# EAGLE schematic 3D-Druck-Platine (EAGLE 7.4.0)
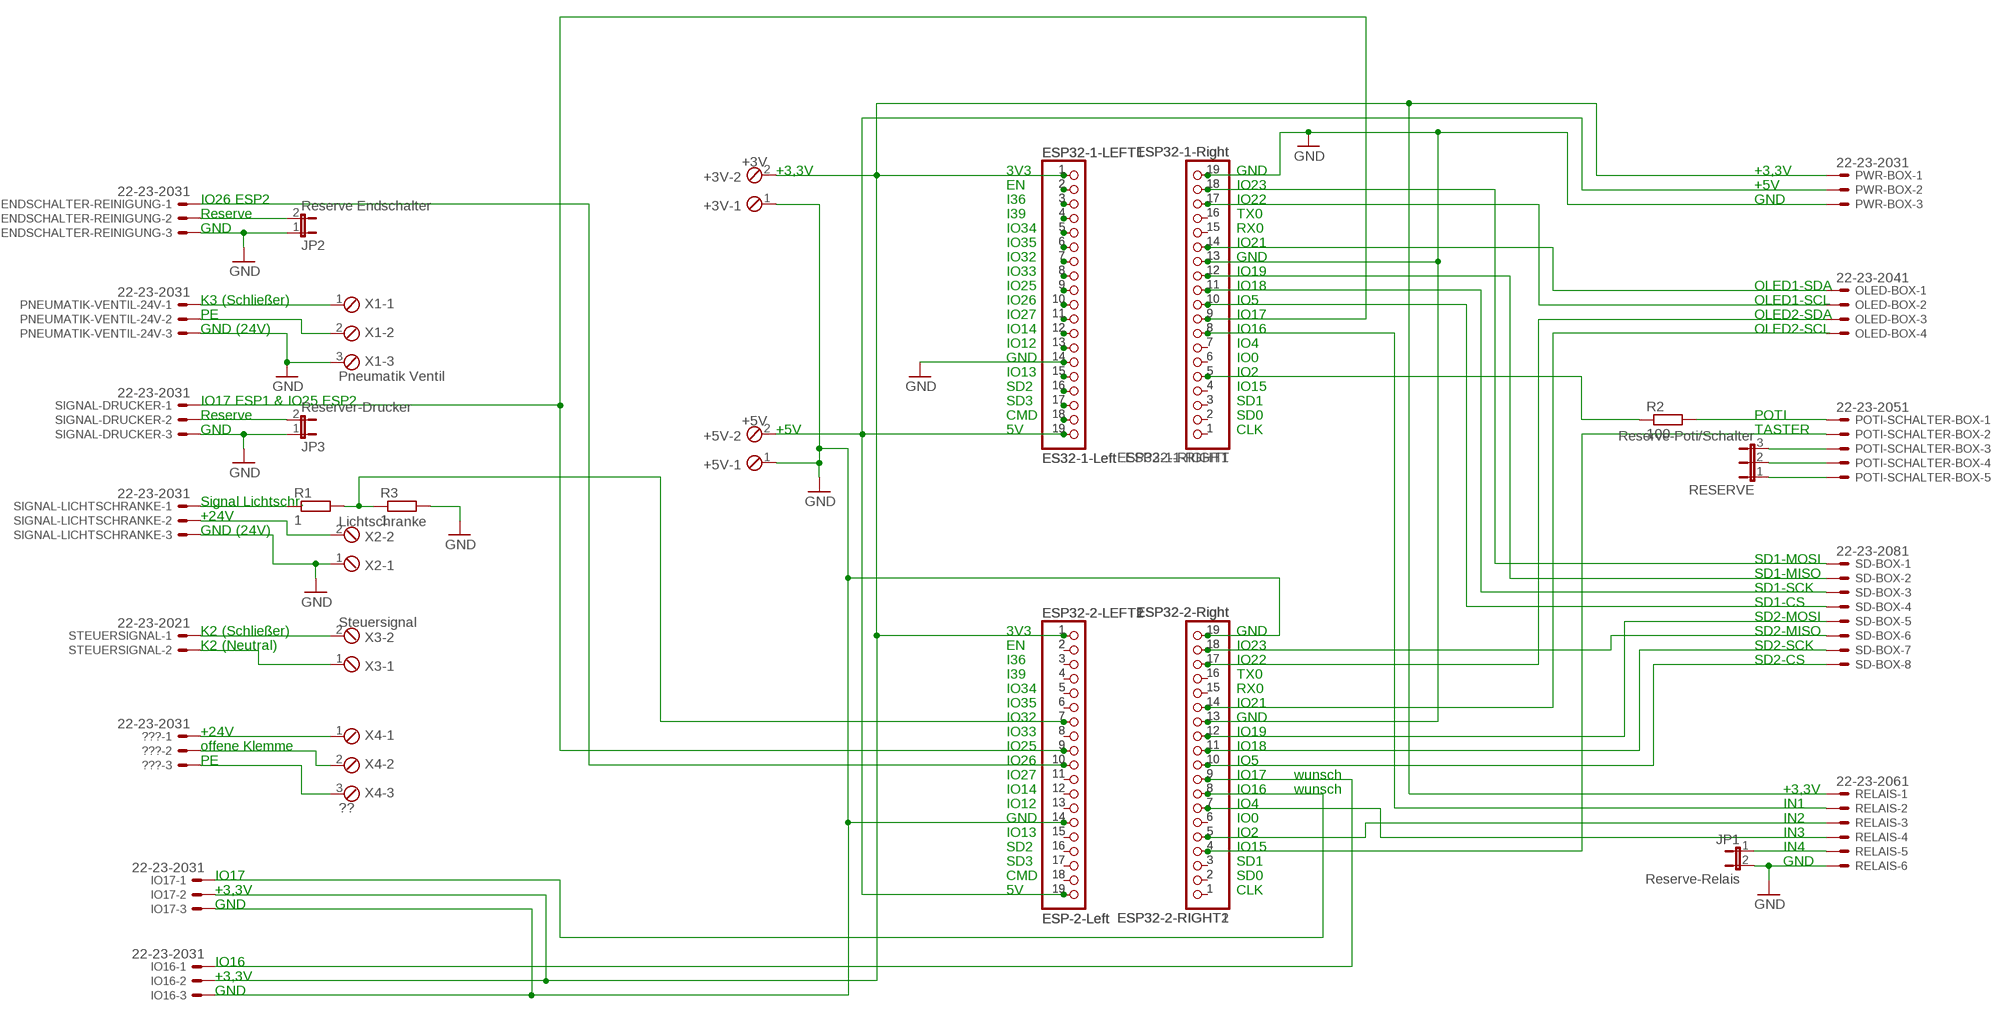
[diagram p0: schematic, sheet 1]

## Parts
+3V  +3V  MPT2  [2POL254]
+5V  +5V  MPT2  [2POL254]
???  22-23-2031  [22-23-2031]
ENDSCHALTER-REINIGUNG  22-23-2031  [22-23-2031]
ESP32-1-LEFT  ES32-1-Left  PINHD-1X19  [1X19]
ESP32-1-LEFT1  ES32-1-Left  PINHD-1X19  [1X19]
ESP32-1-RIGHT  ESP32-1-Right  PINHD-1X19  [1X19]
ESP32-1-RIGHT1  ESP32-1-Right  PINHD-1X19  [1X19]
ESP32-2-LEFT1  ESP-2-Left  PINHD-1X19  [1X19]
ESP32-2-LEFT2  ESP-2-Left  PINHD-1X19  [1X19]
ESP32-2-RIGHT1  ESP32-2-Right  PINHD-1X19  [1X19]
ESP32-2-RIGHT2  ESP32-2-Right  PINHD-1X19  [1X19]
IO16  22-23-2031  [22-23-2031]
IO17  22-23-2031  [22-23-2031]
JP1  Reserve-Relais  JP1E  [JP1]
JP2  Reserve Endschalter  JP1E  [JP1]
JP3  Reserver-Drucker  JP1E  [JP1]
OLED-BOX  22-23-2041  [22-23-2041]
PNEUMATIK-VENTIL-24V  22-23-2031  [22-23-2031]
POTI-SCHALTER-BOX  22-23-2051  [22-23-2051]
PWR-BOX  22-23-2031  [22-23-2031]
R1  1  R-EU_0207/10  [0207/10]
R2  100  R-EU_0207/10  [0207/10]
R3  1  R-EU_0207/10  [0207/10]
RELAIS  22-23-2061  [22-23-2061]
RESERVE  Reserve-Poti/Schalter  JP2E  [JP2]
SD-BOX  22-23-2081  [22-23-2081]
SIGNAL-DRUCKER  22-23-2031  [22-23-2031]
SIGNAL-LICHTSCHRANKE  22-23-2031  [22-23-2031]
STEUERSIGNAL  22-23-2021  [22-23-2021]
X1  Pneumatik Ventil  MPT3  [3POL254]
X2  Lichtschranke  MPT2  [2POL254]
X3  Steuersignal  MPT2  [2POL254]
X4  ??  MPT3  [3POL254]

## Nets
GND: +3V.1 +5V.1 ENDSCHALTER-REINIGUNG.3 ESP32-1-LEFT1.14 ESP32-1-LEFT.14 ESP32-1-RIGHT1.13 ESP32-1-RIGHT1.19 ESP32-1-RIGHT.13 ESP32-1-RIGHT.19 ESP32-2-LEFT1.14 ESP32-2-LEFT2.14 ESP32-2-RIGHT1.13 ESP32-2-RIGHT1.19 ESP32-2-RIGHT2.13 ESP32-2-RIGHT2.19 IO16.3 IO17.3 JP1.2 JP2.1 JP3.1 PNEUMATIK-VENTIL-24V.3 PWR-BOX.3 R3.2 RELAIS.6 SIGNAL-DRUCKER.3 SIGNAL-LICHTSCHRANKE.3 X1.3 X2.1
N$1: ESP32-1-LEFT1.2 ESP32-1-LEFT.2
N$2: POTI-SCHALTER-BOX.3 RESERVE.3
N$3: ESP32-1-LEFT1.3 ESP32-1-LEFT.3
N$3V: +3V.2 ESP32-1-LEFT1.1 ESP32-1-LEFT.1 ESP32-2-LEFT1.1 ESP32-2-LEFT2.1 IO16.2 IO17.2 PWR-BOX.1 RELAIS.1
N$4: POTI-SCHALTER-BOX.4 RESERVE.2
N$5: POTI-SCHALTER-BOX.5 RESERVE.1
N$5V: +5V.2 ESP32-1-LEFT1.19 ESP32-1-LEFT.19 ESP32-2-LEFT1.19 ESP32-2-LEFT2.19 PWR-BOX.2
N$6: ESP32-1-LEFT1.4 ESP32-1-LEFT.4
N$7: ESP32-1-LEFT1.5 ESP32-1-LEFT.5
N$8: ENDSCHALTER-REINIGUNG.2 JP2.2
N$9: ESP32-1-LEFT1.6 ESP32-1-LEFT.6
N$10: JP3.2 SIGNAL-DRUCKER.2
N$11: R1.1 SIGNAL-LICHTSCHRANKE.1
N$12: SIGNAL-LICHTSCHRANKE.2 X2.2
N$13: PNEUMATIK-VENTIL-24V.1 X1.1
N$14: STEUERSIGNAL.1 X3.2
N$15: STEUERSIGNAL.2 X3.1
N$16: PNEUMATIK-VENTIL-24V.2 X1.2
N$17: ???.1 X4.1
N$18: ???.2 X4.2
N$19: ???.3 X4.3
N$20: JP1.1 RELAIS.5
N$21: ESP32-1-LEFT1.7 ESP32-1-LEFT.7
N$22: ESP32-1-LEFT1.8 ESP32-1-LEFT.8
N$23: ESP32-1-LEFT1.9 ESP32-1-LEFT.9
N$24: ESP32-1-LEFT1.10 ESP32-1-LEFT.10
N$25: ESP32-1-LEFT1.11 ESP32-1-LEFT.11
N$26: ESP32-1-LEFT1.12 ESP32-1-LEFT.12
N$27: ESP32-1-LEFT1.13 ESP32-1-LEFT.13
N$28: ESP32-1-LEFT1.15 ESP32-1-LEFT.15
N$29: ESP32-1-LEFT1.16 ESP32-1-LEFT.16
N$30: ESP32-1-LEFT1.17 ESP32-1-LEFT.17
N$31: ESP32-1-LEFT1.18 ESP32-1-LEFT.18
N$32: ESP32-1-RIGHT1.1 ESP32-1-RIGHT.1
N$33: ESP32-1-RIGHT1.2 ESP32-1-RIGHT.2
N$34: ESP32-1-RIGHT1.3 ESP32-1-RIGHT.3
N$35: ESP32-1-RIGHT1.4 ESP32-1-RIGHT.4
N$37: ESP32-1-RIGHT1.7 ESP32-1-RIGHT.7
N$38: ESP32-1-RIGHT1.15 ESP32-1-RIGHT.15
N$39: ESP32-1-RIGHT1.16 ESP32-1-RIGHT.16
N$40: ESP32-2-LEFT1.2 ESP32-2-LEFT2.2
N$41: ESP32-2-LEFT1.3 ESP32-2-LEFT2.3
N$42: ESP32-2-LEFT1.4 ESP32-2-LEFT2.4
N$43: ESP32-2-LEFT1.5 ESP32-2-LEFT2.5
N$44: ESP32-2-LEFT1.6 ESP32-2-LEFT2.6
N$45: ESP32-2-LEFT1.8 ESP32-2-LEFT2.8
N$46: ESP32-2-LEFT1.11 ESP32-2-LEFT2.11
N$47: ESP32-2-LEFT1.12 ESP32-2-LEFT2.12
N$48: ESP32-2-LEFT1.13 ESP32-2-LEFT2.13
N$49: ESP32-2-LEFT1.15 ESP32-2-LEFT2.15
N$50: ESP32-2-LEFT1.16 ESP32-2-LEFT2.16
N$51: ESP32-2-LEFT1.17 ESP32-2-LEFT2.17
N$52: ESP32-2-LEFT1.18 ESP32-2-LEFT2.18
N$53: ESP32-2-RIGHT1.1 ESP32-2-RIGHT2.1
N$54: ESP32-2-RIGHT1.2 ESP32-2-RIGHT2.2
N$55: ESP32-2-RIGHT1.3 ESP32-2-RIGHT2.3
N$57: ESP32-2-RIGHT1.6 ESP32-2-RIGHT2.6
N$58: ESP32-2-RIGHT1.15 ESP32-2-RIGHT2.15
N$59: POTI-SCHALTER-BOX.1 R2.2
N$60: ESP32-1-RIGHT1.6 ESP32-1-RIGHT.6
N$101: ESP32-2-RIGHT1.16 ESP32-2-RIGHT2.16
N$ESP1-18: ESP32-1-RIGHT1.11 ESP32-1-RIGHT.11 SD-BOX.3
N$ESP1-IO2: ESP32-1-RIGHT1.5 ESP32-1-RIGHT.5 R2.1
N$ESP1-IO5: ESP32-1-RIGHT1.10 ESP32-1-RIGHT.10 SD-BOX.4
N$ESP1-IO16: ESP32-1-RIGHT1.8 ESP32-1-RIGHT.8 RELAIS.2
N$ESP1-IO17_ESP2-IO25: ESP32-1-RIGHT1.9 ESP32-1-RIGHT.9 ESP32-2-LEFT1.9 ESP32-2-LEFT2.9 SIGNAL-DRUCKER.1
N$ESP1-IO19: ESP32-1-RIGHT1.12 ESP32-1-RIGHT.12 SD-BOX.2
N$ESP1-IO21: ESP32-1-RIGHT1.14 ESP32-1-RIGHT.14 OLED-BOX.1
N$ESP1-IO22: ESP32-1-RIGHT1.17 ESP32-1-RIGHT.17 OLED-BOX.2
N$ESP1-IO23: ESP32-1-RIGHT1.18 ESP32-1-RIGHT.18 SD-BOX.1
N$ESP2-IO2: ESP32-2-RIGHT1.5 ESP32-2-RIGHT2.5 RELAIS.3
N$ESP2-IO4: ESP32-2-RIGHT1.7 ESP32-2-RIGHT2.7 RELAIS.4
N$ESP2-IO5: ESP32-2-RIGHT1.10 ESP32-2-RIGHT2.10 SD-BOX.8
N$ESP2-IO15: ESP32-2-RIGHT1.4 ESP32-2-RIGHT2.4 POTI-SCHALTER-BOX.2
N$ESP2-IO16: ESP32-2-RIGHT1.8 ESP32-2-RIGHT2.8 IO17.1
N$ESP2-IO17: ESP32-2-RIGHT1.9 ESP32-2-RIGHT2.9 IO16.1
N$ESP2-IO18: ESP32-2-RIGHT1.11 ESP32-2-RIGHT2.11 SD-BOX.7
N$ESP2-IO19: ESP32-2-RIGHT1.12 ESP32-2-RIGHT2.12 SD-BOX.5
N$ESP2-IO21: ESP32-2-RIGHT1.14 ESP32-2-RIGHT2.14 OLED-BOX.4
N$ESP2-IO22: ESP32-2-RIGHT1.17 ESP32-2-RIGHT2.17 OLED-BOX.3
N$ESP2-IO23: ESP32-2-RIGHT1.18 ESP32-2-RIGHT2.18 SD-BOX.6
N$ESP2-IO26: ENDSCHALTER-REINIGUNG.1 ESP32-2-LEFT1.10 ESP32-2-LEFT2.10
N$ESP2-IO32: ESP32-2-LEFT1.7 ESP32-2-LEFT2.7 R1.2 R3.1

## Notes on the sheet
- +3,3V | 3V3 | GND | +3,3V
- EN | IO23 | +5V
- IO26 ESP2 | I36 | IO22 | GND
- Reserve | I39 | TX0
- GND | IO34 | RX0
- IO35 | IO21
- IO32 | GND
- IO33 | IO19
- IO25 | IO18 | OLED1-SDA
- K3 (Schließer) | IO26 | IO5 | OLED1-SCL
- PE | IO27 | IO17 | OLED2-SDA
- GND (24V) | IO14 | IO16 | OLED2-SCL
- IO12 | IO4
- GND | IO0
- IO13 | IO2
- SD2 | IO15
- IO17 ESP1 & IO25 ESP2 | SD3 | SD1
- Reserve | CMD | SD0 | POTI
- GND | +5V | 5V | CLK | TASTER
- Signal Lichtschr.
- +24V
- GND (24V)
- SD1-MOSI
- SD1-MISO
- SD1-SCK
- SD1-CS
- SD2-MOSI
- K2 (Schließer) | 3V3 | GND | SD2-MISO
- K2 (Neutral) | EN | IO23 | SD2-SCK
- I36 | IO22 | SD2-CS
- I39 | TX0
- IO34 | RX0
- IO35 | IO21
- IO32 | GND
- +24V | IO33 | IO19
- offene Klemme | IO25 | IO18
- PE | IO26 | IO5
- IO27 | IO17 | wunsch
- IO14 | IO16 | wunsch | +3,3V
- IO12 | IO4 | IN1
- GND | IO0 | IN2
- IO13 | IO2 | IN3
- SD2 | IO15 | IN4
- SD3 | SD1 | GND
- IO17 | CMD | SD0
- +3,3V | 5V | CLK
- GND
- IO16
- +3,3V
- GND

## Library data of the parts
+3V +5V X2 X3 = con-phoenix-254:MPT2: PHOENIX CONNECTOR; OC_FARNELL: unknown; OC_NEWARK: unknown
??? ENDSCHALTER-REINIGUNG IO16 IO17 PNEUMATIK-VENTIL-24V PWR-BOX SIGNAL-DRUCKER SIGNAL-LICHTSCHRANKE = con-molex:22-23-2031: .100" (2.54mm) Center Header - 3 Pin; MF: MOLEX; MPN: 22-23-2031; OC_FARNELL: 1462950; OC_NEWARK: 30C0862
ESP32-1-LEFT ESP32-1-LEFT1 ESP32-1-RIGHT ESP32-1-RIGHT1 ESP32-2-LEFT1 ESP32-2-LEFT2 ESP32-2-RIGHT1 ESP32-2-RIGHT2 = pinhead:PINHD-1X19: PIN HEADER
JP1-JP3 = jumper:JP1E: JUMPER
OLED-BOX = con-molex:22-23-2041: .100" (2.54mm) Center Header - 4 Pin; MF: MOLEX; MPN: 22-23-2041; OC_FARNELL: 1462920; OC_NEWARK: 38C0355
POTI-SCHALTER-BOX = con-molex:22-23-2051: .100" (2.54mm) Center Header - 5 Pin; MF: MOLEX; MPN: 22-23-2051; OC_FARNELL: 1462952; OC_NEWARK: 38C9178
R1-R3 = rcl:R-EU_: RESISTOR, European symbol
RELAIS = con-molex:22-23-2061: .100" (2.54mm) Center Header - 6 Pin; MF: MOLEX; MPN: 22-23-2061; OC_FARNELL: 1462922; OC_NEWARK: 27C1933
RESERVE = jumper:JP2E: JUMPER
SD-BOX = con-molex:22-23-2081: .100" (2.54mm) Center Header - 8 Pin; MF: MOLEX; MPN: 22-23-2081; OC_FARNELL: 1756826; OC_NEWARK: 01C7592
STEUERSIGNAL = con-molex:22-23-2021: .100" (2.54mm) Center Header - 2 Pin; MF: MOLEX; MPN: 22-23-2021; OC_FARNELL: 1462926; OC_NEWARK: 25C3832
X1 X4 = con-phoenix-254:MPT3: PHOENIX CONNECTOR; OC_FARNELL: unknown; OC_NEWARK: unknown